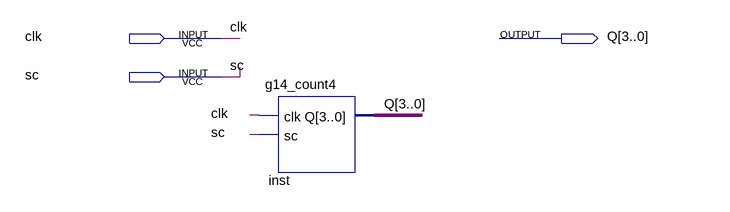
[diagram p0: schematic sheet]
// Quartus schematic g14_lab1_count4.bdf as structural Verilog: 1 symbols, 3 pins
module g14_lab1_count4 (
  input  clk,
  input  sc,
  output [3:0] Q
);

  g14_count4 inst (.clk(clk), .sc(sc), .Q(Q));
endmodule
